# Altium project NaviU.PrjPCB
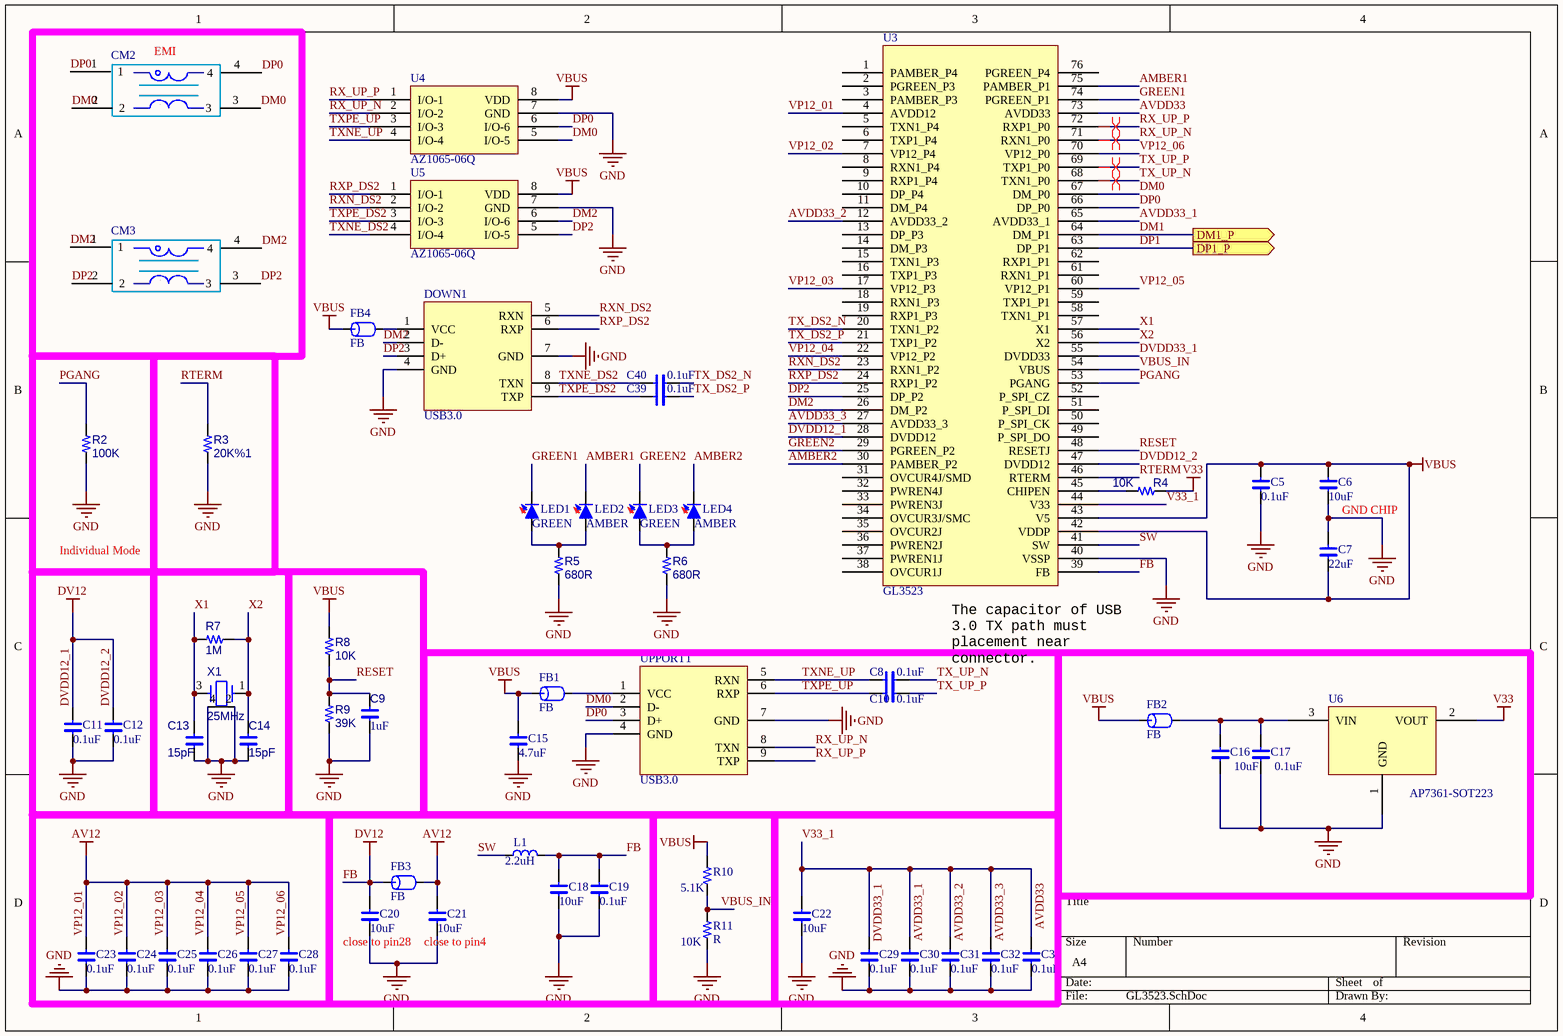
[diagram p0: GL3523.SchDoc]
3 sheets, 78 parts. Net scope: flat (ports and power ports of the same name join across sheets).
Board file: NaviU.PcbDoc
Sheets:
  GL3523.SchDoc
  CP2102.SchDoc
  UM220 NEO-M8.SchDoc

## Sheet GL3523.SchDoc
size A4

### Parts
C5  C  [0402CAPC1005X06N]  (value not drawn)
C6  C  [0603CAPC1608X09N]  (value not drawn)
C7  C  [0603CAPC1608X09N]  (value not drawn)
C8  C  [0402CAPC1005X06N]  (value not drawn)
C9  15pF  [0402CAPC1005X06N]  (value not drawn)
C10  C  [0402CAPC1005X06N]  (value not drawn)
C11  C  [0402CAPC1005X06N]  (value not drawn)
C12  C  [0402CAPC1005X06N]  (value not drawn)
C13  15pF  [0402CAPC1005X06N]
C14  15pF  [0402CAPC1005X06N]
C15  C  [0603CAPC1608X09N]  (value not drawn)
C16  C  [0603CAPC1608X09N]  (value not drawn)
C17  C  [0402CAPC1005X06N]  (value not drawn)
C18  C  [0603CAPC1608X09N]  (value not drawn)
C19  C  [0402CAPC1005X06N]  (value not drawn)
C20  C  [0603CAPC1608X09N]  (value not drawn)
C21  C  [0603CAPC1608X09N]  (value not drawn)
C22  C  [0603CAPC1608X09N]  (value not drawn)
C23  C  [0402CAPC1005X06N]  (value not drawn)
C24  C  [0402CAPC1005X06N]  (value not drawn)
C25  C  [0402CAPC1005X06N]  (value not drawn)
C26  C  [0402CAPC1005X06N]  (value not drawn)
C27  C  [0402CAPC1005X06N]  (value not drawn)
C28  C  [0402CAPC1005X06N]  (value not drawn)
C29  C  [0402CAPC1005X06N]  (value not drawn)
C30  C  [0402CAPC1005X06N]  (value not drawn)
C31  C  [0402CAPC1005X06N]  (value not drawn)
C32  C  [0402CAPC1005X06N]  (value not drawn)
C33  C  [0402CAPC1005X06N]  (value not drawn)
C39  C  [0402CAPC1005X06N]  (value not drawn)
C40  C  [0402CAPC1005X06N]  (value not drawn)
CM2  CM  [SMD_4P]  (value not drawn)
CM3  CM  [SMD_4P]  (value not drawn)
DOWN1  USB3.0  [USB3.0-A-Pin]
FB1  FB  [0805FB]
FB2  FB  [0805FB]
FB3  FB  [0805FB]
FB4  FB  [0805FB]
L1  L  [0805FB]  (value not drawn)
LED1  GREEN  [0603LEDC1608X04N]
LED2  AMBER  [0603LEDC1608X04N]
LED3  GREEN  [0603LEDC1608X04N]
LED4  AMBER  [0603LEDC1608X04N]
R2  100K  [0402RESC1005X04N]
R3  20K%1  [0402RESC1005X04N]
R4  10K  [0402RESC1005X04N]
R5  680R  [0402RESC1005X04N]
R6  680R  [0402RESC1005X04N]
R7  1M  [0402RESC1005X04N]
R8  10K  [0402RESC1005X04N]
R9  39K  [0402RESC1005X04N]
R10  R  [0603R]  (value not drawn)
R11  R  [0603R]
U3  GL3523  [QFN-76]
U4  AZ1065-06Q  [MSOP-8]
U5  AZ1065-06Q  [MSOP-8]
U6  AP7361-SOT223  [SOT230P700X180-4N]
UPPORT1  USB3.0  [USB3.0-G]
X1  25MHz  [CPX-32]

### Blocks framed on the sheet
EMI: CM2 CM3
Individual Mode: R2

### Ports
DM1_P (out), DP1_P (out)

### Nets
DVDD12_1: C11.2 C12.2 C18.2 C19.2 C20.2 FB3.1 L1.2 U3.28(DVDD12) U3.39(FB) U3.47(DVDD12)  [also labelled DV12, DVDD12_2, FB]
GND: C5.1 C6.1 C7.2 C9.2 C11.1 C12.1 C13.1 C14.2 C15.1 C16.1 C17.1 C18.1 C19.1 C20.1 C21.1 C22.1 C23.1 C24.1 C25.1 C26.1 C27.1 C28.1 C29.1 C30.1 C31.1 C32.1 C33.1 DOWN1.4(GND) DOWN1.7(GND) R2.2 R3.2 R5.2 R6.2 R9.2 R11.1 U3.40(VSSP) U4.7(GND) U5.7(GND) U6.1(GND) UPPORT1.4(GND) UPPORT1.7(GND) X1.2(GND) X1.4(GND)
V33: R4.1 U6.2(VOUT)
VBUS: C5.2 C6.2 C7.1 C15.2 FB1.1 FB2.1 FB4.1 R8.1 R10.2 U3.42(VDDP) U3.43(V5) U4.8(VDD) U5.8(VDD)
VP12_01: C21.2 C23.2 C24.2 C25.2 C26.2 C27.2 C28.2 FB3.2 U3.4(AVDD12) U3.7(VP12_P4) U3.17(VP12_P3) U3.22(VP12_P2) U3.60(VP12_P1) U3.70(VP12_P0)  [also labelled AV12, VP12_02, VP12_03, VP12_04, VP12_05, VP12_06]
AMBER1: LED2.K U3.75(PAMBER_P1)
AMBER2: LED4.K U3.30(PAMBER_P2)
AVDD33: C22.2 C29.2 C30.2 C31.2 C32.2 C33.2 U3.12(AVDD33_2) U3.27(AVDD33_3) U3.44(V33) U3.55(DVDD33) U3.65(AVDD33_1) U3.73(AVDD33)  [also labelled AVDD33_1, AVDD33_2, AVDD33_3, DVDD33_1, V33_1]
DM0: CM2.2 CM2.3 U3.67(DM_P0) U4.5(I/O-5) UPPORT1.2(D-)
DM1: U3.64(DM_P1) ; port DM1_P
DM2: CM3.1 CM3.4 DOWN1.2(D-) U3.26(DM_P2) U5.6(I/O-6)
DP0: CM2.1 CM2.4 U3.66(DP_P0) U4.6(I/O-6) UPPORT1.3(D+)
DP1: U3.63(DP_P1) ; port DP1_P
DP2: CM3.2 CM3.3 DOWN1.3(D+) U3.25(DP_P2) U5.5(I/O-5)
GREEN1: LED1.K U3.74(PGREEN_P1)
GREEN2: LED3.K U3.29(PGREEN_P2)
PGANG: R2.1 U3.53(PGANG)
RESET: C9.1 R8.2 R9.1 U3.48(RESETJ)
RTERM: R3.1 U3.46(RTERM)
RX_UP_N: U3.71(RXN1_P0) U4.2(I/O-2) UPPORT1.8(TXN)
RX_UP_P: U3.72(RXP1_P0) U4.1(I/O-1) UPPORT1.9(TXP)
RXN_DS2: DOWN1.5(RXN) U3.23(RXN1_P2) U5.2(I/O-2)
RXP_DS2: DOWN1.6(RXP) U3.24(RXP1_P2) U5.1(I/O-1)
SW: L1.1 U3.41(SW)
TX_DS2_N: C40.1 U3.20(TXN1_P2)
TX_DS2_P: C39.1 U3.21(TXP1_P2)
TX_UP_N: C8.1 U3.68(TXN1_P0)
TX_UP_P: C10.1 U3.69(TXP1_P0)
TXNE_DS2: C40.2 DOWN1.8(TXN) U5.4(I/O-4)
TXNE_UP: C8.2 U4.4(I/O-4) UPPORT1.5(RXN)
TXPE_DS2: C39.2 DOWN1.9(TXP) U5.3(I/O-3)
TXPE_UP: C10.2 U4.3(I/O-3) UPPORT1.6(RXP)
VBUS_IN: R10.1 R11.2 U3.54(VBUS)
X1: C13.2 R7.2 U3.57(X1) X1.3(X2)
X2: C14.1 R7.1 U3.56(X2) X1.1(X1)
NetC16_2: C16.2 C17.2 FB2.2 U6.3(VIN)
NetDOWN1_1: DOWN1.1(VCC) FB4.2
NetFB1_2: FB1.2 UPPORT1.1(VCC)
NetLED1_A: LED1.A LED2.A R5.1
NetLED3_A: LED3.A LED4.A R6.1
NetR4_2: R4.2 U3.45(CHIPEN)

Not connected (* = marked no-connect by the designer): U3 1(PAMBER_P4) 2(PGREEN_P3) 3(PAMBER_P3) 5(TXN1_P4) 6(TXP1_P4) 8(RXN1_P4) 9(RXP1_P4) 10(DP_P4) 11(DM_P4) 13(DP_P3) 14(DM_P3) 15(TXN1_P3) 16(TXP1_P3) 18(RXN1_P3) 19(RXP1_P3) 31(OVCUR4J/SMD) 32(PWREN4J) 33(PWREN3J) 34(OVCUR3J/SMC) 35(OVCUR2J) 36(PWREN2J) 37(PWREN1J) 38(OVCUR1J) 49(P_SPI_DO) 50(P_SPI_CK) 51(P_SPI_DI) 52(P_SPI_CZ) 58(TXN1_P1) 59(TXP1_P1) 61(RXN1_P1) 62(RXP1_P1) 76(PGREEN_P4)

### Layout directives
differential pair: RX_UP_N, RX_UP_P, TX_UP_N, TX_UP_P

### Notes on the sheet
- GND CHIP
- (near U3) The capacitor of USB 3.0 TX path must
  placement near connector.
- close to pin28
- (near C21) close to pin4
- (in symbol C) 10uF; 0.1uF; 22uF; 1uF; 4.7uF
- (in symbol L) 2.2uH
- (in symbol R) 5.1K; 10K

### Library data of the parts
C9 C13 C14 = C
CM2 CM3 = CM: USB Comon Choke
LED1-LED4 = LED: Chip LED; Published: 2013.8.4; Publisher: ChenTao; PackageVersion: ver1.0
R2-R9 = R
U6 = AMS1117-3.3
X1 = CRYSTAL-4
FB1-FB4 = FB: Text Field1: FB; FB: *

## Sheet CP2102.SchDoc
size A4
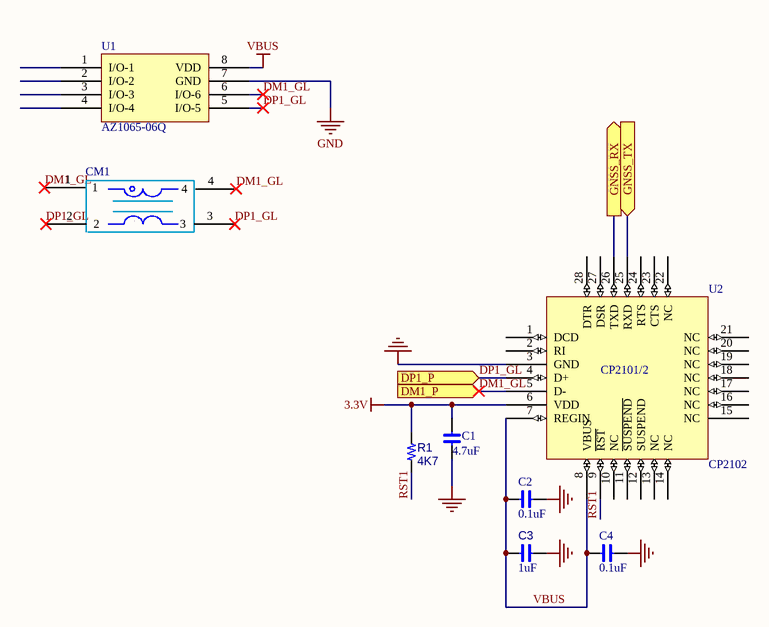
[diagram p1: CP2102.SchDoc]

### Parts
C1  C  [0603CAPC1608X09N]  (value not drawn)
C2  C  [0402CAPC1005X06N]  (value not drawn)
C3  15pF  [0402CAPC1005X06N]  (value not drawn)
C4  C  [0402CAPC1005X06N]  (value not drawn)
CM1  CM  [SMD_4P]  (value not drawn)
R1  4K7  [0402RESC1005X04N]
U1  AZ1065-06Q  [MSOP-8]
U2  CP2102  [QFN-28]

### Ports
DM1_P (in), DP1_P (in), GNSS_RX (out), GNSS_TX (in)

### Nets
3.3V: C1.2 R1.1 U2.6(VDD)
GND: C1.1 C2.1 C3.2 C4.1 U1.7(GND) U2.3(GND)
VBUS: C2.2 C3.1 C4.2 U1.8(VDD) U2.7(REGIN) U2.8(VBUS)
DM1_GL: CM1.1 CM1.4 U1.6(I/O-6) U2.5(D-) ; port DM1_P  [project net DM1]
DP1_GL: CM1.2 CM1.3 U1.5(I/O-5) U2.4(D+) ; port DP1_P  [project net DP1]
RST1: R1.2 U2.9(~{RST})
NetU2_25: U2.25(RXD) ; port GNSS_TX
NetU2_26: U2.26(TXD) ; port GNSS_RX

Not connected (* = marked no-connect by the designer): U1 1(I/O-1) 2(I/O-2) 3(I/O-3) 4(I/O-4); U2 1(DCD) 2(RI) 10(NC) 11(~{SUSPEND}) 12(SUSPEND) 13(NC) 14(NC) 15(NC) 16(NC) 17(NC) 18(NC) 19(NC) 20(NC) 21(NC) 22(NC) 23(CTS) 24(RTS) 27(DSR) 28(DTR)

### Notes on the sheet
- (in symbol C) 4.7uF; 0.1uF; 1uF

### Library data of the parts
C3 = C
CM1 = CM: USB Comon Choke
R1 = R
U2 = CP2101/2

## Sheet UM220 NEO-M8.SchDoc
size A4
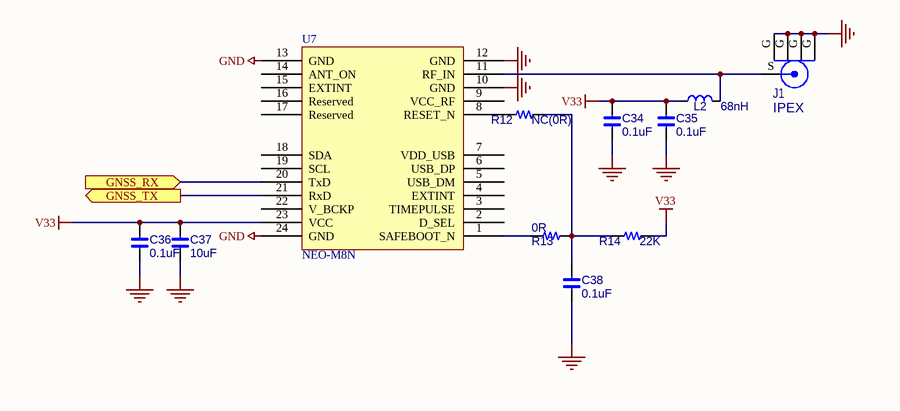
[diagram p2: UM220 NEO-M8.SchDoc]

### Parts
C34  0.1uF  [0402CAPC1005X06N]
C35  0.1uF  [0402CAPC1005X06N]
C36  0.1uF  [0402CAPC1005X06N]
C37  10uF  [0603CAPC1608X09N]
C38  0.1uF  [0402CAPC1005X06N]
J1  IPEX  [IPEX]
L2  68nH  [0402RESC1005X04N]
R12  NC(0R)  [0402RESC1005X04N]
R13  0R  [0402RESC1005X04N]
R14  22K  [0402RESC1005X04N]
U7  NEO-M8N  [UM220]

### Ports
GNSS_RX (in), GNSS_TX (out)

### Nets
GND: C34.2 C35.2 C36.2 C37.2 C38.2 J1.G(Ground) U7.10(GND) U7.12(GND) U7.13(GND) U7.24(GND)
V33: C34.1 C35.1 C36.1 C37.1 L2.1 R14.2 U7.23(VCC)
NetC38_1: C38.1 R12.2 R13.2 R14.1
NetJ1_S: J1.S(Signal) L2.2 U7.11(RF_IN)
NetR12_1: R12.1 U7.8(RESET_N)
NetR13_1: R13.1 U7.1(SAFEBOOT_N)
NetU2_25: U7.21(RxD) ; port GNSS_TX
NetU2_26: U7.20(TxD) ; port GNSS_RX

Not connected (* = marked no-connect by the designer): U7 2(D_SEL) 3(TIMEPULSE) 4(EXTINT) 5(USB_DM) 6(USB_DP) 7(VDD_USB) 9(VCC_RF) 14(ANT_ON) 15(EXTINT) 16(Reserved) 17(Reserved) 18(SDA) 19(SCL) 22(V_BCKP)

### Library data of the parts
C34-C38 = C
J1 = RF Connector: Published: 2013.8.4; Publisher: ChenTao; PackageVersion: ver1.0
L2 = L
R12-R14 = R

## Nets that join several sheets
GND: GL3523 (43 pins), CP2102 (6 pins), UM220 NEO-M8 (10 pins)
V33: GL3523 (R4.1 U6.2), UM220 NEO-M8 (7 pins)
VBUS: GL3523 (13 pins), CP2102 (6 pins)
DM1: GL3523 (U3.64), CP2102 (CM1.1 CM1.4 U1.6 U2.5)
DP1: GL3523 (U3.63), CP2102 (CM1.2 CM1.3 U1.5 U2.4)
NetU2_25: CP2102 (U2.25), UM220 NEO-M8 (U7.21)
NetU2_26: CP2102 (U2.26), UM220 NEO-M8 (U7.20)